# Altium schematic sheet PowerSupply.SchDoc
size A4
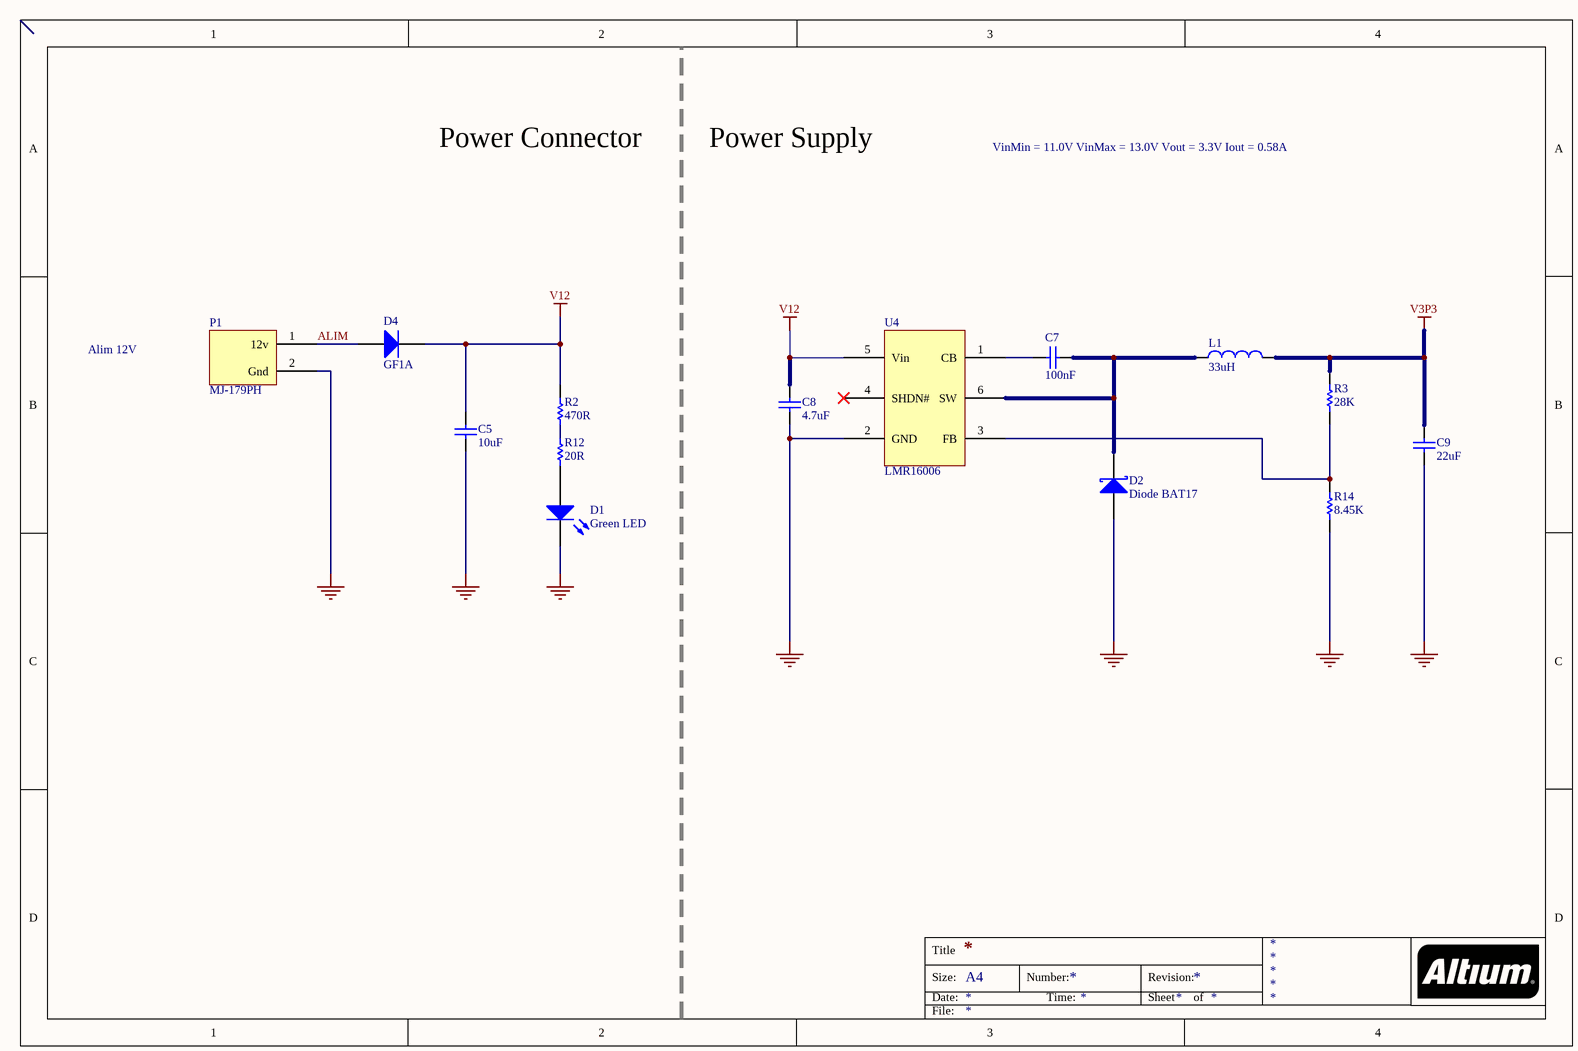
[diagram p0: PowerSupply.SchDoc]

## Parts
C5  10uF  [CAP 0603]
C7  100nF  [CAP 0603]  (no BOM)
C8  4.7uF  [CAP 0603]  (no BOM)
C9  22uF  [CAP 0603]  (no BOM)
D1  Green LED  [LED 2012]  (no BOM)
D2  Diode BAT17  [SOD-123F 12 mm]  (no BOM)
D4  GF1A  [SMA/DO-214AC_21]
L1  33uH  [IND]  (no BOM)
P1  MJ-179PH  [DC Jack]  (no BOM)
R2  470R  [RES 0603]  (no BOM)
R3  28K  [RES 0603]
R12  20R  [RES 0603]  (no BOM)
R14  8.45K  [RES 0603]
U4  LMR16006  [SOT (6)]

## Nets
GND: C5.1 C8.2 C9.2 D1.2(K) D2.1(A) P1.2(Gnd) R14.1 U4.2(GND)
V3P3: C9.1 L1.2 R3.2
V12: C5.2 C8.1 D4.2(K) R2.2 U4.5(Vin)
ALIM: D4.1(A) P1.1(12v)
NetC7_1: C7.1 U4.1(CB)
NetC7_2: C7.2 D2.3(K) L1.1 U4.6(SW)
NetD1_1: D1.1(A) R12.1
NetR2_1: R2.1 R12.2
NetR3_1: R3.1 R14.2 U4.3(FB)

Not connected (* = marked no-connect by the designer): U4 4(SHDN#)*

## Notes on the sheet
- Power Connector
- Power Supply
- VinMin = 11.0V VinMax = 13.0V Vout = 3.3V Iout = 0.58A
- Alim 12V
- Title
- Size:
- Date:
- A4
- Number:
- Time:
- Revision:
- Sheet
- of
- File:

## Library data of the parts
C5 = Cap: Capacitor; Fabricant: TDK; RefFabricant: C2012X5R0J106M/1.25; Fournisseur: Farnell; RefFournisseur: 2309029; Precision: 6,3V X5R; Published: 8-Jun-2000; LatestRevisionDate: 17-Jul-2002; LatestRevisionNote: Re-released for DXP Platform.; PackageReference: RAD-0.3; Publisher: Altium Limited; PackageDescription: Radial Cap, Thru-Hole; 2 Leads; 0.3 in Pin Spacing; Value: 10uF
C7 = Cap: Capacitor; Fournisseur: Farnell; RefFournisseur: 1740665; Fabricant: AVX; RefFabricant: 08053C104KAT2A; Published: 8-Jun-2000; LatestRevisionDate: 17-Jul-2002; LatestRevisionNote: Re-released for DXP Platform.; PackageReference: RAD-0.3; Publisher: Altium Limited; PackageDescription: Radial Cap, Thru-Hole; 2 Leads; 0.3 in Pin Spacing; Value: 100nF
C8 = Cap: Capacitor; Value: 100pF; Fabricant: MURATA; RefFabricant: GRM21BR61E475MA12L; Fournisseur: Farnell; RefFournisseur: 2362111; Published: 8-Jun-2000; LatestRevisionDate: 17-Jul-2002; LatestRevisionNote: Re-released for DXP Platform.; PackageReference: RAD-0.3; Publisher: Altium Limited; PackageDescription: Radial Cap, Thru-Hole; 2 Leads; 0.3 in Pin Spacing
C9 = Cap: Capacitor; Value: 100pF; Fournisseur: Farnell; RefFournisseur: 2666555; RefFabricant: GRM21BR60J226ME39L; Fabricant: MURATA; Published: 8-Jun-2000; LatestRevisionDate: 17-Jul-2002; LatestRevisionNote: Re-released for DXP Platform.; PackageReference: RAD-0.3; Publisher: Altium Limited; PackageDescription: Radial Cap, Thru-Hole; 2 Leads; 0.3 in Pin Spacing
D1 = LED2: Typical INFRARED GaAs LED; Fabricant: KINGBRIGHT; RefFabricant: KPT-2012SGC; Fournisseur: Farnell; RefFournisseur: 2099239; Published: 8-Jun-2000; LatestRevisionDate: 17-Jul-2002; LatestRevisionNote: Re-released for DXP Platform.; PackageVersion: Feb-2002; PackageReference: 3.2X1.6X1.1; Publisher: Altium Limited; PackageDescription: SM LED; 2 Flat Leads
D2 = Diode BAT17: Silicon RF Schottky Diode for Mixer Applications in the VHF/UHF Range; Note: Pin 2 is not connected and not drawn.; RefFournisseur: 2371113; Fournisseur: Farnell; RefFabricant: PMEG6010CEH,115; Fabricant: NEXPERIA; Published: 21-Mar-2003; LatestRevisionDate: 29-May-2009; LatestRevisionNote: IPC-7351 Footprint Added.; DatasheetVersion: Oct-1999; PackageVersion: Sep-2001; PackageReference: SOT-23; Publisher: Altium Limited; PackageDescription: 3-Pin SOT-23 Package 0.95 mm Pitch, 2.5 mm Lead Span; ComponentLink1Description: Manufacturer Link; ComponentLink1URL: http://www.infineon.com/; ComponentLink2Description: Datasheet; ComponentLink2URL: http://www.infineon.com/upload/Document/cmc_upload/documents/009/363/bat17series.pdf
D4 = Diode: Default Diode; Fabricant: VISHAY; RefFabricant: GF1A-E3/67A; Fournisseur: Farnell; RefFournisseur: 9549560; Published: 8-Jun-2000; LatestRevisionDate: 17-Jul-2002; LatestRevisionNote: Re-released for DXP Platform.; PackageVersion: Sep-1996; PackageReference: SMC; Publisher: Altium Limited; PackageDescription: DO-214-AB/SMC; 2 C-Bend Leads; Body 7.9 x 5.9 mm, inc. leads (LxW); Code_JEDEC: DO-214-AB
L1 = Inductor: Code_IEC: 1005; Value: 10mH; RefFournisseur: 2288270; Fournisseur: Farnell; RefFabricant: MSS1048-333MLC; Fabricant: COILCRAFT; Published: 8-Jun-2000; LatestRevisionDate: 29-May-2009; LatestRevisionNote: IPC-7351 Footprint Added.; PackageReference: 0402-A; Publisher: Altium Limited; PackageDescription: Chip Inductor; Code_JEITA: 0402
P1 = MJ-179PH: Connecteurs DC Jacks; Fabricant: MULTICOMP; Fournisseur: Farnell; RefFournisseur: 1737246; RefFabricant: MJ-179PH
R2 R12 = Res1: Resistor; Precision: 1%; RefFabricant: PCF0805-13-470R-B-T1; Fabricant: WELWYN; Fournisseur: Farnell; RefFournisseur: 1108854; Published: 8-Jun-2000; LatestRevisionDate: 17-Jul-2002; LatestRevisionNote: Re-released for DXP Platform.; PackageReference: AXIAL-0.3; Publisher: Altium Limited; PackageDescription: Axial Device, Thru-Hole; 2 Leads; 0.3 in Pin Spacing
  R2: Value: 470R
  R12: Value: 20R
R3 = Res1: Resistor; Value: 27K; Fabricant: VISHAY; RefFabricant: CRCW040228K0FKED; RefFournisseur: 2140888; Fournisseur: Farnell; Published: 8-Jun-2000; LatestRevisionDate: 17-Jul-2002; LatestRevisionNote: Re-released for DXP Platform.; PackageReference: AXIAL-0.3; Publisher: Altium Limited; PackageDescription: Axial Device, Thru-Hole; 2 Leads; 0.3 in Pin Spacing
R14 = Res1: Resistor; Value: 150R; Fournisseur: Farnell; RefFournisseur: 2140852; Fabricant: VISHAY; RefFabricant: CRCW04028K45FKED; Published: 8-Jun-2000; LatestRevisionDate: 17-Jul-2002; LatestRevisionNote: Re-released for DXP Platform.; PackageReference: AXIAL-0.3; Publisher: Altium Limited; PackageDescription: Axial Device, Thru-Hole; 2 Leads; 0.3 in Pin Spacing
U4 = LMR16006: Régulateurs à découpage DC/DC ajustables; Fabricant: Texas Instruments; RefFabricant: LMR16006YDDC; Fournisseur: Farnell; RefFournisseur: 2455134